# EAGLE schematic Seal (EAGLE 9.7.0)
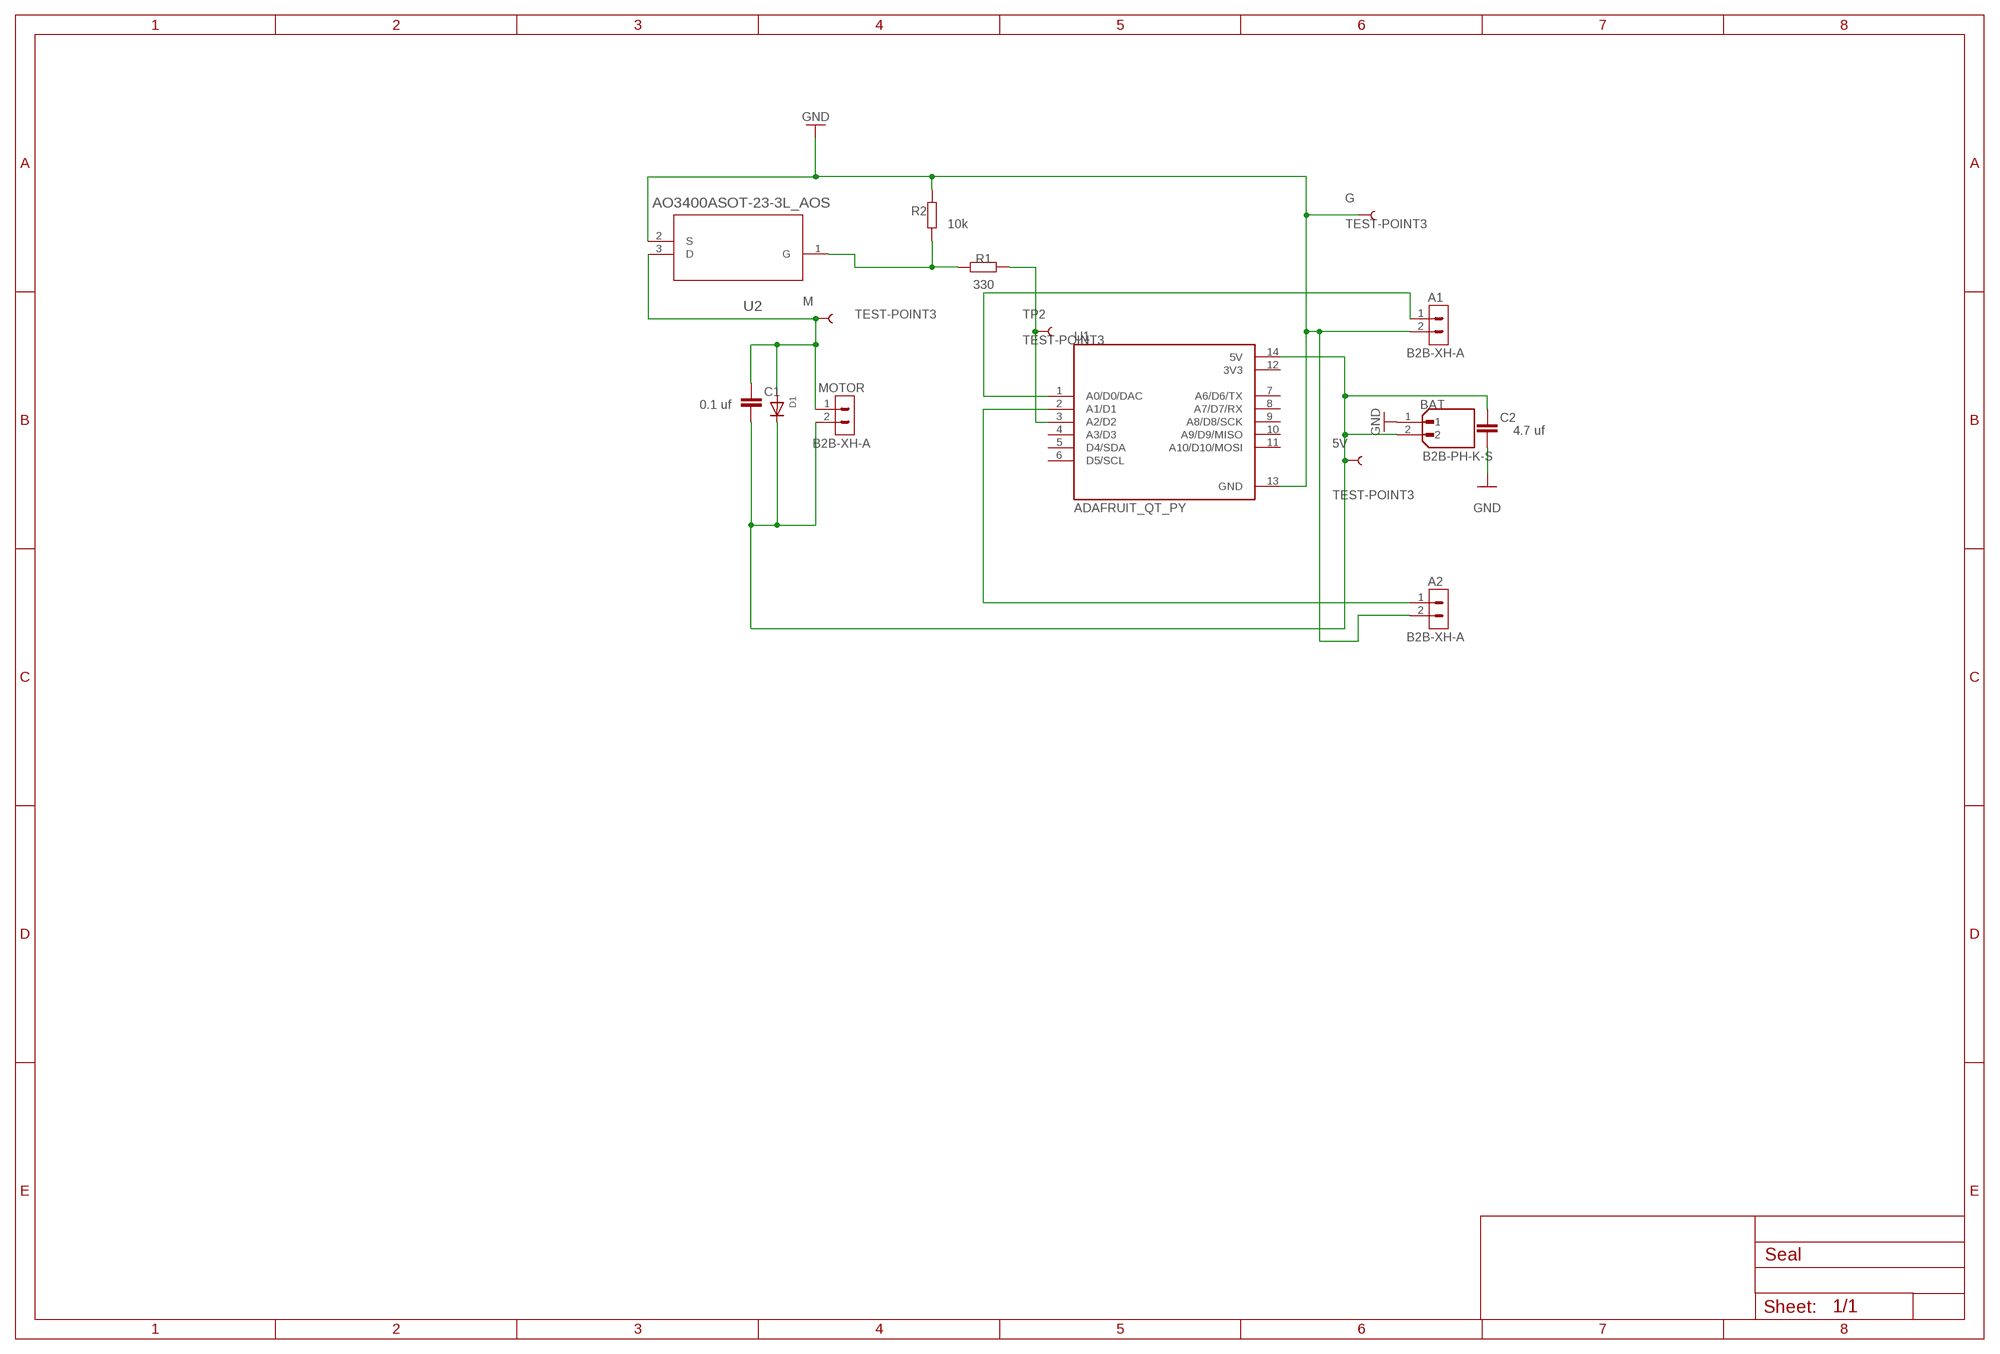
[diagram p0: schematic, sheet 1]

## Parts
5V  TEST-POINT3  [PAD.03X.03]
A1  B2B-XH-A  [B2B-XH-A]
A2  B2B-XH-A  [B2B-XH-A]
BAT  B2B-PH-K-S  [JST_B2B-PH-K-S]
C1  0.1 uf  C_CHIP-0603(1608-METRIC)  [CAPC1608X85]
C2  4.7 uf  C_CHIP-0603(1608-METRIC)  [CAPC1608X85]
D1  DIODESOD-123  [SOD-123]
G  TEST-POINT3  [PAD.03X.03]
M  TEST-POINT3  [PAD.03X.03]
MOTOR  B2B-XH-A  [B2B-XH-A]
R1  330  R_CHIP-0402(1005-METRIC)  [RESC1005X40]
R2  10k  R_CHIP-0402(1005-METRIC)  [RESC1005X40]
TP2  TEST-POINT3  [PAD.03X.03]
U1  ADAFRUIT_QT_PY  [MODULE_ADAFRUIT_QT_PY]
U2  AO3400ASOT-23-3L_AOS  [SOT-23-3L_AOS]

## Nets
GND: A1.2 A2.2 BAT.1 C2.2 G.1 R2.2 U1.13(GND) U2.2(S)
GPIO: R1.2 TP2.1 U1.3(A2/D2)
N$2: C1.1 D1.A M.1 MOTOR.1 U2.3(D)
N$4: A1.1 U1.1(A0/D0/DAC)
N$5: A2.1 U1.2(A1/D1)
N$7: 5V.1 BAT.2 C1.2 C2.1 D1.C MOTOR.2 U1.14(5V)
N$8: R1.1 R2.1 U2.1(G)
Unconnected: U1.4(A3/D3) U1.5(D4/SDA) U1.6(D5/SCL) U1.7(A6/D6/TX) U1.8(A7/D7/RX) U1.9(A8/D8/SCK) U1.10(A9/D9/MISO) U1.11(A10/D10/MOSI)

## Power pins joined to a net without a drawn wire
3V3: U1.12(3V3)

## Library data of the parts
5V G M TP2 = SparkFun-Connectors:TEST-POINT: SparkFun Test Points Bare copper test points for troubleshooting or In-Circuit-Testing. These are used by our Production team for verifying production board runs using pogo-pins on test beds. SparkFun Products: SparkFun LSM9DS1 Breakout <https://www.sparkfun.com/products/13284> SparkFun PSOC <https://www.sparkfun.com/products/13714> SparkFun Load Cell Amplifier <https://www.sparkfun.com/products/13879>
A1 A2 MOTOR = Connector:B2B-XH-A: XH Connector Top Entry - 2POS Reference: : Datasheet <http://www.jst-mfg.com/product/pdf/eng/eXH.pdf>; CATEGORY: Connectors; DATASHEET: https://www.jst-mfg.com/product/pdf/eng/eXH.pdf; DESCRIPTION: Connector Header Through Hole 2 position 0.098" (2.50mm); MANUFACTURER: JST Sales America Inc.; MPN: B2B-XH-A; OPERATING_TEMPERATURE: -25°C ~ 85°C; PACKAGE_SIZE: NA; PACKAGE_TYPE: Through Hole; PART_STATUS: Active; PITCH: 0.098" (2.50mm); ROHS: Compliant; SERIES: XH; SUBCATEGORY: Rectangular Connectors; TYPE: Male Headers
BAT = B2B-PH-K-S:B2B-PH-K-S: Check availability <https://pricing.snapeda.com/parts/B2B-PH-K-S/JST%20Sales/view-part?ref=eda>; AVAILABILITY: In Stock; CHECK_PRICES: https://www.snapeda.com/parts/B2B-PH-K-S/JST/view-part/?ref=eda; DESCRIPTION: Connector Header Through Hole 2 position 0.079 (2.00mm); MF: JST Sales; MP: B2B-PH-K-S; PACKAGE: None; PRICE: None; SNAPEDA_LINK: https://www.snapeda.com/parts/B2B-PH-K-S/JST/view-part/?ref=snap
C1 C2 = Tutorial - Fusion 360:C: Capacitor - Generic; CATEGORY: Capacitor
D1 = adafruit:DIODE: Diode SMADIODE - SMA Surface Mount Package 20V 1A Schottky Diode Digikey: 641-1014-6-ND DO-1N4148 - Through Hole Small Current Diode SOD-123 20V 1 A (.5mV Vf) Schottky Diode - Digikey: MBRX120TPMSCT-ND SOD-323 10V 570mA (.38mV Vf, 3ns) Schottky Diode - Digikey: ZLLS410CT-ND SOD-523 30V 30mA Schottky Diode (RB751S-40TE61) - Digikey: RB751S-40TE61CT-ND SOT23-R/W - SOT23 Package (R = Solder Paste/Reflow Ovens, W = Hand-Soldering) BAT54Film 40V 300mA - Digikey: 497-7162-1-ND
R1 R2 = Resistor:R: Resistor Fixed - Generic; CATEGORY: Resistors; DESCRIPTION: Chip Resistor 1.05 X 0.54 X 0.40 mm body 0402(1005-METRIC) Package; PACKAGE_SIZE: 0402; PACKAGE_TYPE: Surface Mount
U1 = ADAFRUIT_QT_PY:ADAFRUIT_QT_PY: Check availability <https://pricing.snapeda.com/parts/Adafruit%20QT%20Py/Adafruit%20Industries/view-part?ref=eda>; AVAILABILITY: Not in stock; CHECK_PRICES: https://www.snapeda.com/parts/Adafruit%20QT%20Py/Adafruit+Industries/view-part/?ref=eda; DESCRIPTION: Castellated Pads - SAMD21 Dev Board with STEMMA QT; MF: Adafruit Industries; MP: Adafruit QT Py; PACKAGE: None; PRICE: None; SNAPEDA_LINK: https://www.snapeda.com/parts/Adafruit%20QT%20Py/Adafruit+Industries/view-part/?ref=snap
U2 = 2026-04-10_23-17-07_Library:AO3400A; COPYRIGHT: Copyright (C) 2026 Ultra Librarian. All rights reserved.; DIGI-KEY_PART_NUMBER_1: 785-1000-2-ND; DIGI-KEY_PART_NUMBER_2: 785-1000-1-ND; DIGI-KEY_PART_NUMBER_3: 785-1000-6-ND; DIGI-KEY_PART_NUMBER_4: 785-1000-2-NDL; MANUFACTURER_NAME: Alpha and Omega Semiconductor; MANUFACTURER_PART_NUMBER: AO3400A